# EAGLE design Status Board (EAGLE 9.2.2)
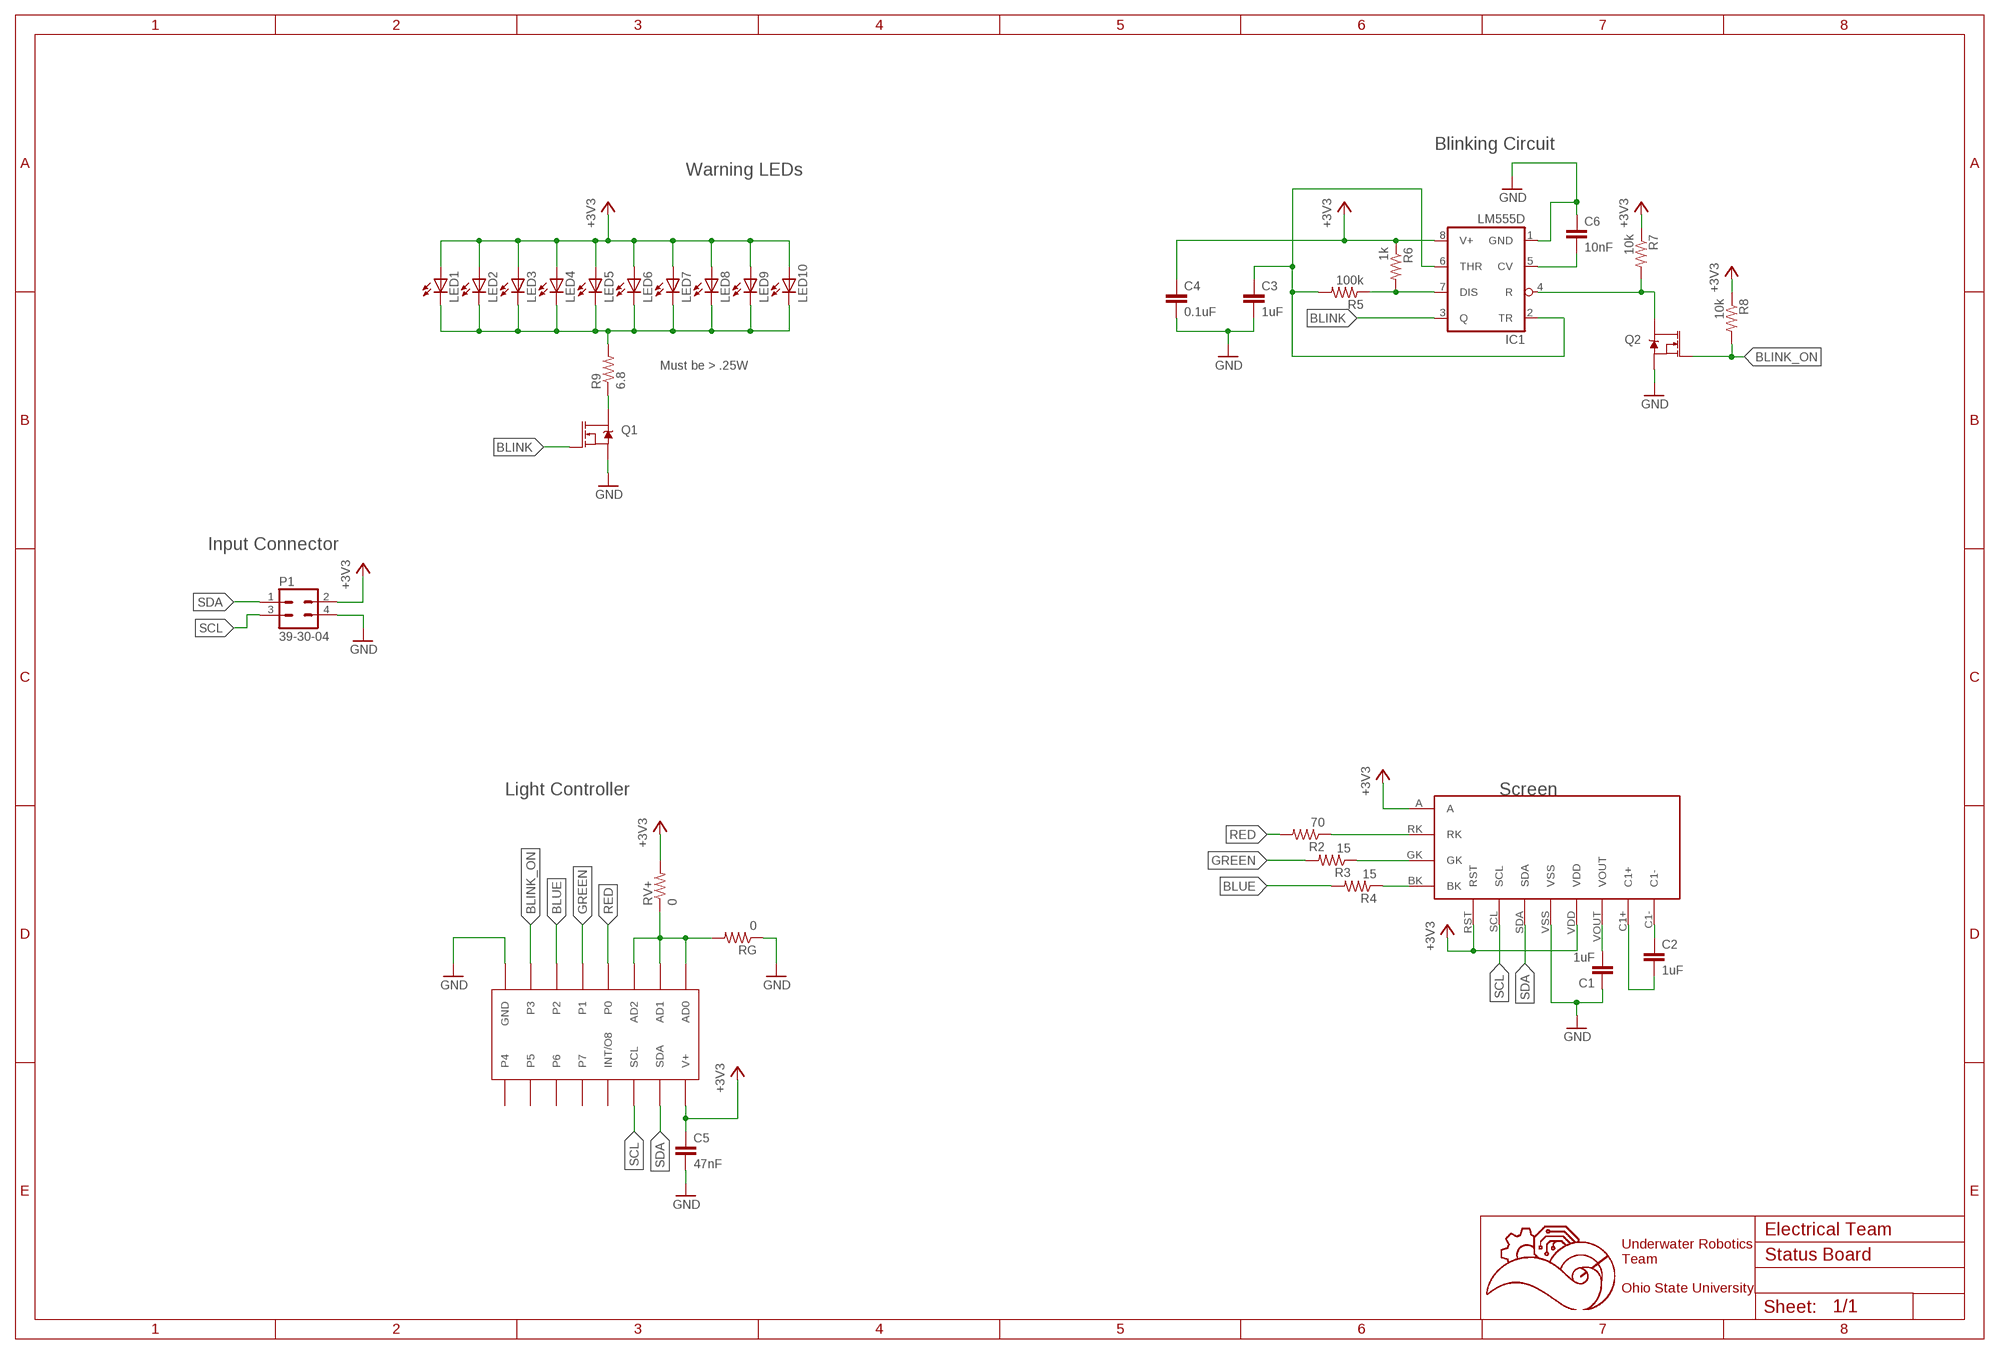
[diagram p0: schematic, sheet 1]

## Parts
C1  1uF  C-EUC0603  [C0603]
C2  1uF  C-EUC0603  [C0603]
C3  1uF  C-EUC0603  [C0603]
C4  0.1uF  C-EUC0603  [C0603]
C5  47nF  C-EUC0603  [C0603]
C6  10nF  C-EUC0603  [C0603]
IC1  LM555D  [SO08]
LED1  LEDCHIPLED_0603  [CHIPLED_0603]
LED2  LEDCHIPLED_0603  [CHIPLED_0603]
LED3  LEDCHIPLED_0603  [CHIPLED_0603]
LED4  LEDCHIPLED_0603  [CHIPLED_0603]
LED5  LEDCHIPLED_0603  [CHIPLED_0603]
LED6  LEDCHIPLED_0603  [CHIPLED_0603]
LED7  LEDCHIPLED_0603  [CHIPLED_0603]
LED8  LEDCHIPLED_0603  [CHIPLED_0603]
LED9  LEDCHIPLED_0603  [CHIPLED_0603]
LED10  LEDCHIPLED_0603  [CHIPLED_0603]
P1  39-30-04  [39-30-?04?]
Q1  310mA/60V/1.6Ω  MOSFET-NCH-2N7002PW  [SOT323]
Q2  310mA/60V/1.6Ω  MOSFET-NCH-2N7002PW  [SOT323]
R2  70  R-US_R0603  [R0603]
R3  15  R-US_R0603  [R0603]
R4  15  R-US_R0603  [R0603]
R5  100k  R-US_R0603  [R0603]
R6  1k  R-US_R0603  [R0603]
R7  10k  R-US_R0603  [R0603]
R8  10k  R-US_R0603  [R0603]
R9  6.8  R-US_R0603  [R0603]
RG  0  R-US_R0603  [R0603]
RV+  0  R-US_R0603  [R0603]
U$1  NHD-C0220BIZ  [NHD-C0220BIZ]
U$2  MAX7315  [TSSOP-16]

## Nets
+3V3: C4.1 C5.1 IC1.8(V+) LED1.A LED2.A LED3.A LED4.A LED5.A LED6.A LED7.A LED8.A LED9.A LED10.A P1.2 R6.1 R7.1 R8.1 RV+.2 U$1.A U$1.RST U$1.VDD U$2.16(V+)
BLINK: IC1.3(Q) Q1.1(G)
BLINK_OFF: IC1.4(R) Q2.3(D) R7.2
BLINK_ON: Q2.1(G) R8.2 U$2.7(P3)
BLUE: R4.2 U$2.6(P2)
GND: C1.1 C3.2 C4.2 C5.2 C6.1 IC1.1(GND) P1.4 Q1.2(S) Q2.2(S) RG.1 U$1.VSS U$2.8(GND)
GREEN: R3.2 U$2.5(P1)
N$1: R3.1 U$1.GK
N$2: C2.1 U$1.C1-
N$3: C1.2 U$1.VOUT
N$4: C2.2 U$1.C1+
N$5: R4.1 U$1.BK
N$6: RG.2 RV+.1 U$2.1(AD0) U$2.2(AD1) U$2.3(AD2)
N$7: R2.1 U$1.RK
N$8: C6.2 IC1.5(CV)
N$9: IC1.7(DIS) R5.1 R6.2
N$10: C3.1 IC1.2(TR) IC1.6(THR) R5.2
N$12: Q1.3(D) R9.1
N$20: LED1.C LED2.C LED3.C LED4.C LED5.C LED6.C LED7.C LED8.C LED9.C LED10.C R9.2
RED: R2.2 U$2.4(P0)
SCL: P1.3 U$1.SCL U$2.14(SCL)
SDA: P1.1 U$1.SDA U$2.15(SDA)
Unconnected: U$2.9(P4) U$2.10(P5) U$2.11(P6) U$2.12(P7) U$2.13(INT/O8)

## Notes on the sheet
- Blinking Circuit
- Warning LEDs
- Must be > .25W
- Input Connector
- Light Controller | Screen
- Electrical Team
- Underwater Robotics
  Team
  
  Ohio State University

## Library data of the parts
C1-C6 = rcl:C-EU: CAPACITOR, European symbol; SPICEPREFIX: C
IC1 = linear:*555: TIMER
LED1-LED10 = led:LED: LED OSRAM: - CHIPLED LG R971, LG N971, LY N971, LG Q971, LY Q971, LO R971, LY R971 LH N974, LH R974 LS Q976, LO Q976, LY Q976 LO Q996 - Hyper CHIPLED LW Q18S LB Q993, LB Q99A, LB R99A - SideLED LS A670, LO A670, LY A670, LG A670, LP A670 LB A673, LV A673, LT A673, LW A673 LH A674 LY A675 LS A676, LA A676, LO A676, LY A676, LW A676 LS A679, LY A679, LG A679 - Hyper Micro SIDELED® LS Y876, LA Y876, LO Y876, LY Y876 LT Y87S - SmartLED LW L88C, LW L88S LB L89C, LB L89S, LG L890 LS L89K, LO L89K, LY L89K LS L896, LA L896, LO L896, LY L896 - TOPLED LS T670, LO T670, LY T670, LG T670, LP T670 LSG T670, LSP T670, LSY T670, LOP T670, LYG T670 LG T671, LOG T671, LSG T671 LB T673, LV T673, LT T673, LW T673 LH T674 LS T676, LA T676, LO T676, LY T676, LB T676, LH T676, LSB T676, LW T676 LB T67C, LV T67C, LT T67C, LS T67K, LO T67K, LY T67K, LW E67C LS E67B, LA E67B, LO E67B, LY E67B, LB E67C, LV E67C, LT E67C LW T67C LS T679, LY T679, LG T679 LS T770, LO T770, LY T770, LG T770, LP T770 LB T773, LV T773, LT T773, LW T773 LH T774 LS E675, LA E675, LY E675, LS T675 LS T776, LA T776, LO T776, LY T776, LB T776 LHGB T686 LT T68C, LB T68C - Hyper Mini TOPLED® LB M676 - Mini TOPLED Santana® LG M470 LS M47K, LO M47K, LY M47K Source: http://www.osram.convergy.de LUXEON: - LUMILED® LXK2-PW12-R00, LXK2-PW12-S00, LXK2-PW14-U00, LXK2-PW14-V00 LXK2-PM12-R00, LXK2-PM12-S00, LXK2-PM14-U00 LXK2-PE12-Q00, LXK2-PE12-R00, LXK2-PE12-S00, LXK2-PE14-T00, LXK2-PE14-U00 LXK2-PB12-K00, LXK2-PB12-L00, LXK2-PB12-M00, LXK2-PB14-N00, LXK2-PB14-P00, LXK2-PB14-Q00 LXK2-PR12-L00, LXK2-PR12-M00, LXK2-PR14-Q00, LXK2-PR14-R00 LXK2-PD12-Q00, LXK2-PD12-R00, LXK2-PD12-S00 LXK2-PH12-R00, LXK2-PH12-S00 LXK2-PL12-P00, LXK2-PL12-Q00, LXK2-PL12-R00 Source: www.luxeon.com KINGBRIGHT: KA-3528ASYC Source: www.kingbright.com
P1 = con-molex-mini-fit:39-30-?04?: HEADER
Q1 Q2 = SparkFun-DiscreteSemi:MOSFET-NCH: N-channel MOSFETs Voltage controlled devices that allow control of high current outputs. SparkFun Products: SparkFun OpenScale <https://www.sparkfun.com/products/13261> SparkFun Digital Sandbox <https://www.sparkfun.com/products/12651> SparkFun Monster Moto Shield <https://www.sparkfun.com/products/10182> SparkFun MOSFET Power Controller <https://www.sparkfun.com/products/11214>; PROD_ID: TRANS-11151
R2-R9 RG RV+ = rcl:R-US_: RESISTOR, American symbol; SPICEPREFIX: R
U$1 = NHD-C0220BiZ:NHD-C0220BIZ
U$2 = MAX7315:MAX7315

## Board
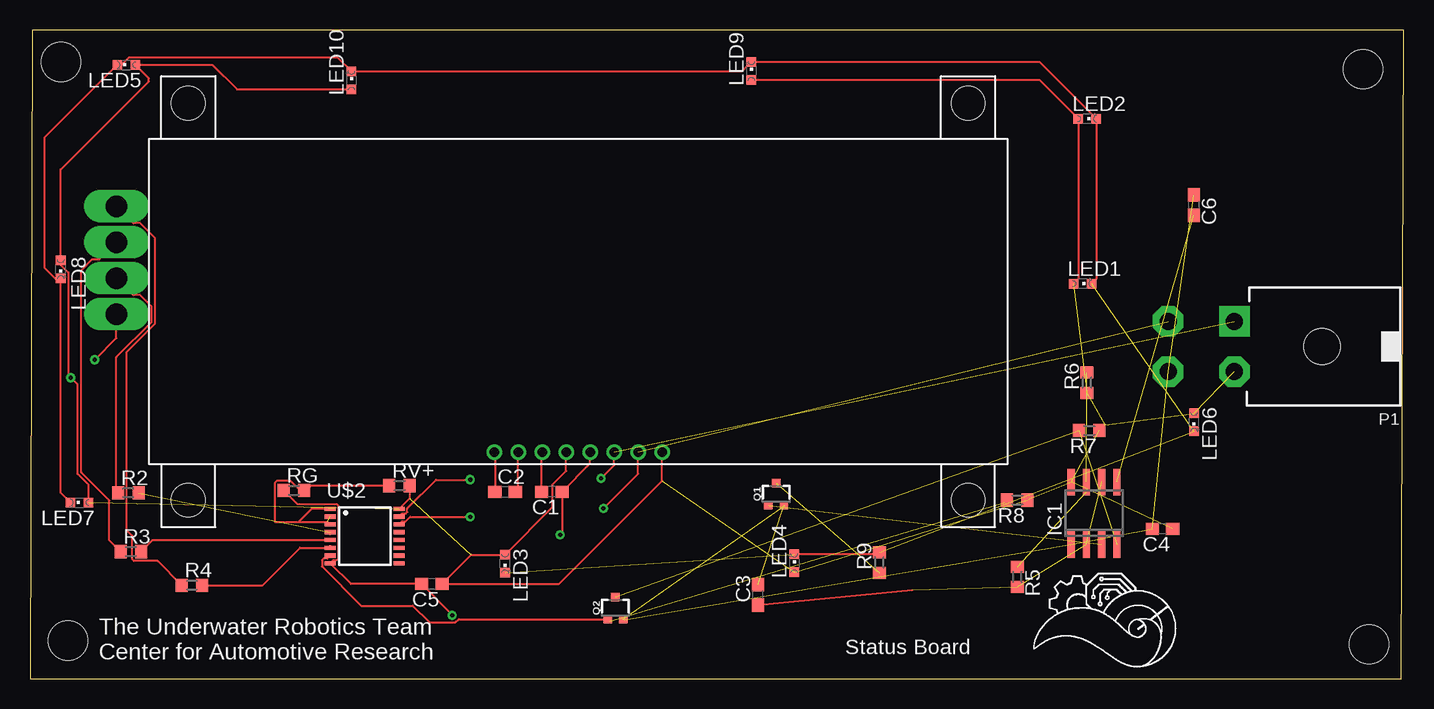
[diagram p1: board, top side]
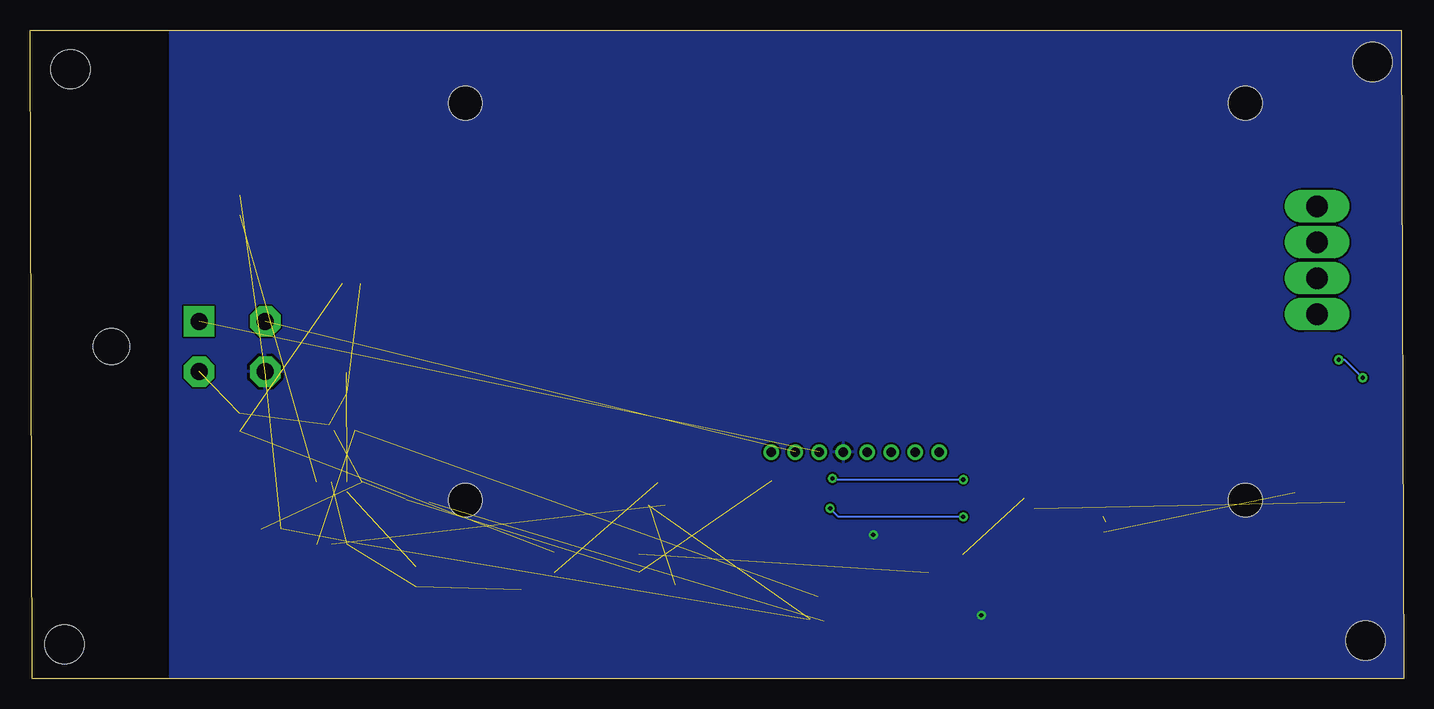
[diagram p2: board, bottom side, seen from below]

Size 114.5 x 54.1 mm. Coordinates in mm from the lower left corner, seen from the top.
Outline: 0,0 114.3,0 114.5,54.1 0.2,54.1 0,0
Copper layers (1*16): Top 0.035mm / dielectric 1.5mm / Bottom 0.035mm
Design rules "default *": minimum track width 6mil, minimum drill 0.35mm, track to track 6mil, track to pad 6mil, pad to pad 6mil, via to via 6mil, smd to smd 6mil, copper to edge 0.00508125mm, drill to drill 6mil, minimum pad ring 10mil, minimum via ring 8mil, stop-mask expansion 4mil, vias tented up to drill 0mil, thermal gap 10mil
Holes 3.26 mm at 2.58,51.42 111.12,50.83 3.17,3.17 111.62,2.88

### Footprints (pad centres in the part's own frame; a part is rotated, then mirrored left to right if it is on the bottom)
C0603 = smd 1.1 x 1: 1 -0.85,0; 2 0.85,0
SO08 = smd 0.6 x 2.2: 1 -1.905,-2.6; 2 -0.635,-2.6; 3 0.635,-2.6; 4 1.905,-2.6; 5 1.905,2.6; 6 0.635,2.6; 7 -0.635,2.6; 8 -1.905,2.6
CHIPLED_0603 = smd 0.8 x 0.8: A 0,-0.75; C 0,0.75
39-30-?04? = drill 1.422 pad 2.54 square: 1 2.095,0 | drill 1.422 pad 2.54 octagon: 2 -2.095,0; 3 2.095,5.512; 4 -2.095,5.512 | hole 3: 0,-7.3
SOT323 = smd 0.7 x 0.7: 1 -0.65,-0.925; 2 0.65,-0.925; 3 0,0.925
R0603 = smd 1 x 1.1: 1 -0.85,0; 2 0.85,0
NHD-C0220BIZ = drill 1.8 long: A -6,15.5; BK -6,24.5; GK -6,21.5; RK -6,18.5 | drill 0.8: C1+ 27.5,4; C1- 25.5,4; RST 39.5,4; SCL 37.5,4; SDA 35.5,4; VDD 31.5,4; VOUT 29.5,4; VSS 33.5,4 | hole 2.8: 0,0; 65,0; 65,33.1; 0,33.1
TSSOP-16 = smd 0.9 x 0.35: 1 -2.875,2.275; 2 -2.875,1.625; 3 -2.875,0.975; 4 -2.875,0.325; 5 -2.875,-0.325; 6 -2.875,-0.975; 7 -2.875,-1.625; 8 -2.875,-2.275; 9 2.875,-2.275; 10 2.875,-1.625; 11 2.875,-0.975; 12 2.875,-0.325; 13 2.875,0.325; 14 2.875,0.975; 15 2.875,1.625; 16 2.875,2.275

### Placement (x,y rotation side)
C1  43.5,15.6 180 top
C2  39.6,15.6 0 top
C3  60.7,7 90 top
C4  94.4,12.5 180 top
C5  0.047uF  [C0603]  33.5,7.9 180 top
C6  0.01uF  [C0603]  97,39.5 270 top
IC1  88.7,13.8 0 top
LED1  87.73,32.94 270 top
LED2  88.13,46.7 270 top
LED3  39.6,9.59 180 top
LED4  63.71,9.63 0 top
LED5  8.03,51.2 90 top
LED6  97.04,21.39 180 top
LED7  4.13,14.69 90 top
LED8  2.56,34.13 180 top
LED9  60.14,50.7 0 top
LED10  26.8,49.9 0 top
P1  39-30-04?  [39-30-?04?]  100.4,27.7 90 top
Q1  62.2,15.4 0 top
Q2  48.8,5.9 0 top
R2  8.2,15.5 0 top
R3  8.4,10.6 0 top
R4  13.5,7.8 0 top
R5  82.3,8.5 270 top
R6  88.1,24.7 90 top
R7  88.3,20.7 180 top
R8  82.3,14.9 180 top
R9  70.8,9.7 90 top
RG  22,15.7 0 top
RV+  30.8,16.1 0 top
U$1  13.2,14.9 0 top
U$2  27.9,11.9 0 top

### Tracks (layer width: path | path; a pad name or v marks a point on that pad's centre or on a via)
+3V3  (via drill 0.35)  (11 unrouted)
  Top 0.152: 89.6,21.15 R7.1 | 83.25,15 R8.1 | RV+.2 31.65,15.05 U$2.16 | U$1.VDD 44.7,17.32 43.57,16.2 43.57,14.31 LED3.A 36.79,10.34 C5.1 44.1,7.9 52.7,16.5 U$1.RST | LED7.A 4.88,16.17 3.97,17.08 3.97,24.53 v3.4,25.1 3.19,25.31 3.19,33.87 2.56,34.5 LED8.A 2.56,42.46 9.9,49.8 9.9,50.07 LED5.A 15.2,51.2 17.25,49.15 LED10.A | v5.4,26.6 7.2,28.4 U$1.A | LED9.A 84.13,49.95 LED2.A 87.38,33.34 LED1.A
  Top 0.508: 97.01,22.14 LED6.A
  Bottom 0.152: v3.4,25.1 4.9,26.6 v5.4,26.6
BLINK  (1 unrouted)
BLINK_OFF  (2 unrouted)
BLINK_ON  (1 unrouted)
  Top 0.152: 81.25,14.7 R8.2 | 48.33,4.8 Q2.1 35.73,4.97 35.45,4.69 33.31,4.69 31.9,6.1 27.6,6.1 24.35,9.36 24.35,9.89 24.48,10.03 24.78,10.03 U$2.7
BLUE
  Top 0.152: R4.2 19.4,7.8 22.52,10.91 25.02,10.91
  Top 0.406: 25.02,10.91 U$2.6
GND  (via drill 0.35)  (6 unrouted)
  Top 0.152: IC1.1 86.8,10.92 | Q2.2 49.52,4.9 | U$1.VSS 46.7,17.95 C1.1 44.35,12.15 v44.2,12 | RG.1 22.27,14.58 25.57,14.58 25.7,14.45 25.7,10.01 25.57,9.87 25.27,9.87 U$2.8 26.75,7.9 C5.2 35.2,5.35 v35.2,5.3
  Top 0.508: Q1.2 62.92,14.47
  pour Bottom: -1.1,77.8 -1.1,-1.4 102.8,-1.4 102.8,77.8
GREEN
  Top 0.152: R3.2 10.22,11.57 U$2.5
N$1
  Top 0.152: U$1.GK 5.78,34.98 5.2,34.98 4.27,34.05 4.27,17.2 6.62,14.86 6.62,11.53 R3.1
N$2
  Top 0.152: U$1.C1- 38.75,18.85 C2.1
N$3
  Top 0.152: C1.2 42.65,18.85 U$1.VOUT
N$4
  Top 0.152: C2.2 40.7,15.85 U$1.C1+
N$5
  Top 0.152: R4.1 10.63,9.82 8.65,9.82 8.52,9.96 8.52,11.93 8.08,12.37 8.08,27.27 10.43,29.62 10.43,36.75 9.2,37.98 8.62,37.98 U$1.BK
N$6  (1 unrouted)
  Top 0.152: 22.4,13.1 20.4,13.1 20.4,16.32 20.55,16.48 21.75,16.48 22.52,15.7 RG.2 23.25,16.1 RV+.1 | 22.4,13.1 24.8,13.1 U$2.3 | U$2.1 23.48,14.18 22.4,13.1
  Top 0.508: 23.15,16 RG.2
N$7
  Top 0.152: R2.1 7.2,15.65 7.2,26.82 10.13,29.75 10.13,31.05 9.2,31.98 8.62,31.98 U$1.RK
N$8  (1 unrouted)
N$9  (2 unrouted)
  Top 0.152: 88.06,15.56 IC1.7
N$10  (3 unrouted)
  Top 0.152: C3.1 73.55,7.4
N$12  (1 unrouted)
N$20  (3 unrouted)
  Top 0.152: R9.2 70.63,10.38 LED4.C | LED7.C 2.56,15.51 LED8.C 2.12,33.38 1.2,34.3 1.2,45.12 LED5.C 7.66,51.2 8.28,51.83 25.62,51.83 LED10.C 59.34,50.65 LED9.C 84.13,51.45 LED2.C 88.88,33.34 LED1.C
RED  (1 unrouted)
  Top 0.406: 25,12.2 U$2.4
SCL  (via drill 0.35)  (1 unrouted)
  Top 0.152: U$2.14 31.02,13.12 31.32,13.12 31.7,13.5 v36.7,13.5 | v47.8,14.2 50.7,17.1 U$1.SCL
  Bottom 0.152: v36.7,13.5 47.1,13.5 v47.8,14.2
SDA  (via drill 0.35)  (1 unrouted)
  Top 0.152: v36.7,16.6 33.85,16.6 31.45,14.2 31.45,13.9 31.32,13.77 31.02,13.77 U$2.15 | v47.6,16.7 48.7,17.8 U$1.SDA
  Bottom 0.152: v36.7,16.6 47.5,16.6 v47.6,16.7

### Text on the board
tPlace: The Underwater Robotics Team / Center for Automotive Research | Status Board